# EAGLE design 12V24V led driver-1 (EAGLE 6.2)
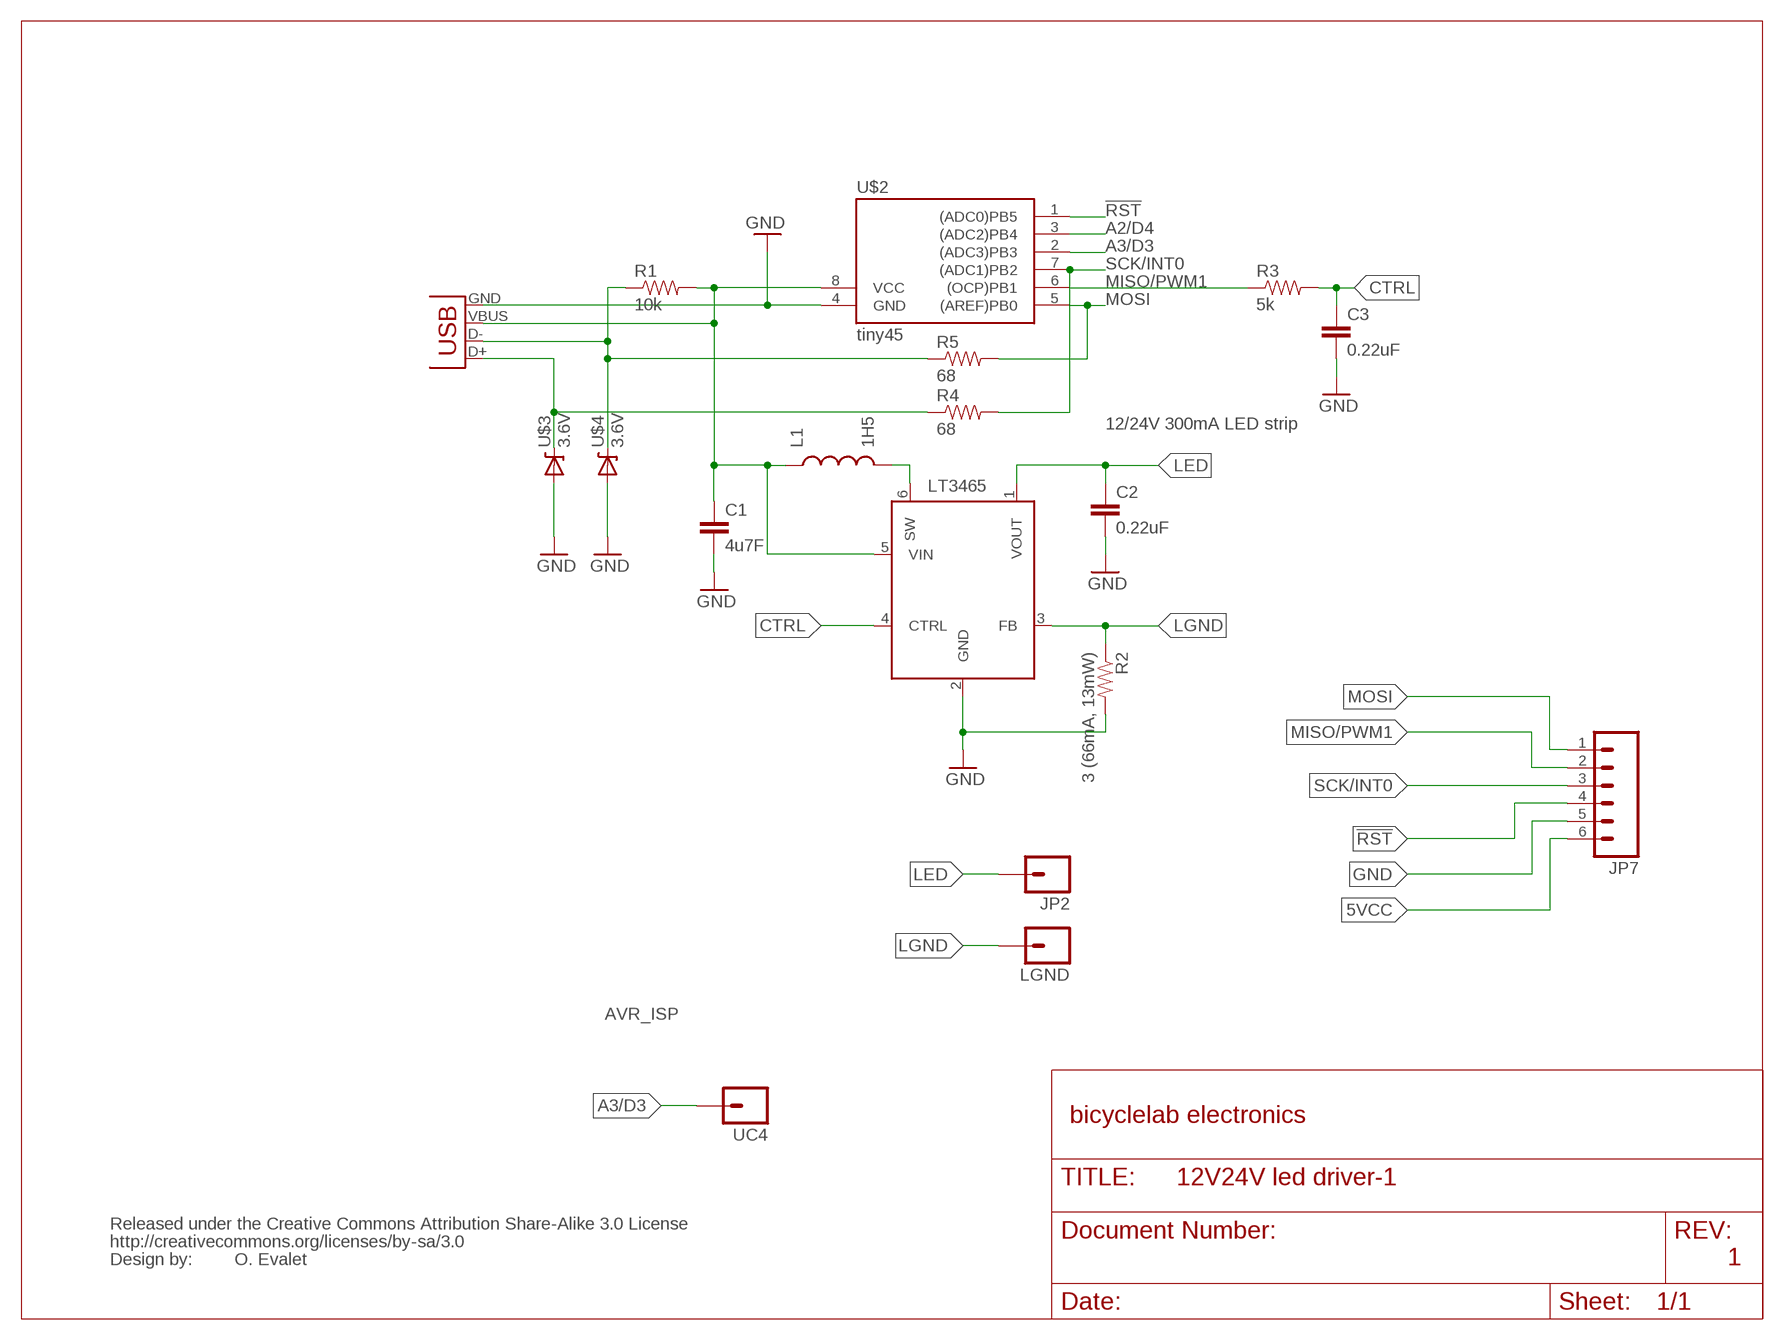
[diagram p0: schematic, sheet 1]

## Parts
C1  4u7F  CAP0805  [0805]
C2  0.22uF  CAP0603-CAP  [0603-CAP]
C3  0.22uF  CAP0805  [0805]
JP2  M01PTH  [1X01]
JP7  M06EM406  [EM406]
L1  1H5  INDUCTOR0805  [0805]
LGND  M01PTH  [1X01]
MISB-SW-5B  MISB-SW-5B  USB-MICROB  [USB-MICROB]
R1  10k  RESISTOR  [0805]
R2  3 (66mA, 13mW)  RESISTOR1206  [1206]
R3  5k  RESISTOR  [0805]
R4  68  RESISTOR  [0805]
R5  68  RESISTOR  [0805]
U$1  LT365  [TSOT23-6_DDC]
U$2  tiny45  TINY25/45/85-20SU  [SOIC8]
U$3  3.6V  DIODE-ZENER-BZT52  [SOD-323]
U$4  3.6V  DIODE-ZENER-BZT52  [SOD-323]
U$5  CREATIVE_COMMONS  [CREATIVE_COMMONS]
UC4  M01SMD-4.5X1.5  [PAD-1.5X4.5]

## Nets
5VCC: C1.1 JP7.6 L1.1 MISB-SW-5B.VBUS R1.2 U$1.5(VIN) U$2.8(VCC)
!RST: JP7.4 U$2.1((ADC0)PB5)
A2/D4: U$2.3((ADC2)PB4)
A3/D3: U$2.2((ADC3)PB3) UC4.P$1
CTRL: C3.1 R3.2 U$1.4(CTRL)
GND: C1.2 C2.2 C3.2 JP7.5 MISB-SW-5B.GND R2.2 U$1.2(GND) U$2.4(GND) U$3.2(A) U$4.2(A)
LED: C2.1 JP2.1 U$1.1(VOUT)
LGND: LGND.1 R2.1 U$1.3(FB)
MISO/PWM1: JP7.2 R3.1 U$2.6((OCP)PB1)
MOSI: JP7.1 R5.2 U$2.5((AREF)PB0)
N$1: MISB-SW-5B.D+ R4.1 U$3.1(C)
N$2: MISB-SW-5B.D- R1.1 R5.1 U$4.1(C)
N$3: L1.2 U$1.6(SW)
SCK/INT0: JP7.3 R4.2 U$2.7((ADC1)PB2)

## Notes on the sheet
- 12/24V 300mA LED strip
- AVR_ISP
- bicyclelab electronics
- O. Evalet | 1

## Library data of the parts
C1-C3 = SparkFun:CAP: Capacitor Standard 0603 ceramic capacitor, and 0.1" leaded capacitor.
JP2 LGND UC4 = SparkFun:M01: Header 1 Standard 1-pin 0.1" header. Use with straight break away headers (SKU : PRT-00116), right angle break away headers (PRT-00553), swiss pins (PRT-00743), machine pins (PRT-00117), and female headers (PRT-00115).
JP7 = 0-SparkFun:M06: Header 6 Standard 6-pin 0.1" header. Use with straight break away headers (SKU : PRT-00116), right angle break away headers (PRT-00553), swiss pins (PRT-00743), machine pins (PRT-00117), and female headers (PRT-00115). Molex polarized connector foot print use with SKU : PRT-08094 with associated crimp pins and housings. NOTES ON THE VARIANTS LOCK and LOCK_LONGPADS... This footprint was designed to help hold the alignment of a through-hole component (i.e. 6-pin header) while soldering it into place. You may notice that each hole has been shifted either up or down by 0.005 of an inch from it's more standard position (which is a perfectly straight line). This slight alteration caused the pins (the squares in the middle) to touch the edges of the holes. Because they are alternating, it causes a "brace" to hold the component in place. 0.005 has proven to be the perfect amount of "off-center" position when using our standard breakaway headers. Although looks a little odd when you look at the bare footprint, once you have a header in there, the alteration is very hard to notice. Also, if you push a header all the way into place, it is covered up entirely on the bottom side. This idea of altering the position of holes to aid alignment will be further integrated into the Sparkfun Library for other footprints. It can help hold any component with 3 or more connection pins.
L1 = 0-SparkFun:INDUCTOR: Inductors Basic Inductor/Choke - 0603 and 1206. Footprints are not proven and vary greatly between part numbers.
MISB-SW-5B = 0-SparkFun:USB: USB Connectors USB-B-PTH is fully proven SKU : PRT-00139 USB-miniB is fully proven SKU : PRT-00587 USB-A-PCB is untested. USB-A-H is throughly reviewed, but untested. Spark Fun Electronics SKU : PRT-00437 USB-B-SMT is throughly reviewed, but untested. Needs silkscreen touching up. USB-A-S has not been used/tested USB-MB-H has not been used/tested
R1-R5 = SparkFun:RESISTOR: Resistor Basic schematic elements and footprints for 0603, 1206, and PTH 1/10th watt (small) resistors.
U$1 = bicyclelab:LT365: 1.2MHz/2.4MHz White LED Drivers with Built-in Schottky in ThinSOT. The LT®3465/LT3465A are step-up DC/DC converters designed to drive up to six LEDs in series from a Li-Ion cell.
U$2 = 0-avr-7:TINY25/45/85
U$3 U$4 = 0-SparkFun:DIODE-ZENER: Zener Diode Production Part - 8199 3.4V Zener Voltage
U$5 = SparkFun:CREATIVE_COMMONS

## Net classes
0 default: width 0.203 mm
1 power: width 0.508 mm

## Board
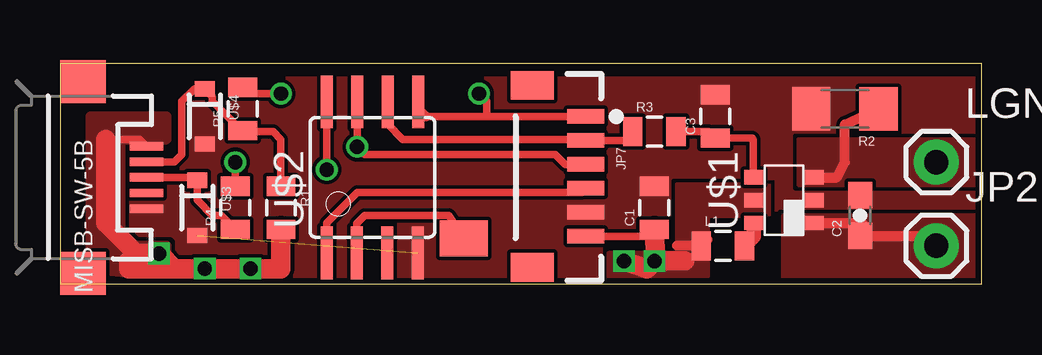
[diagram p1: board, top side]
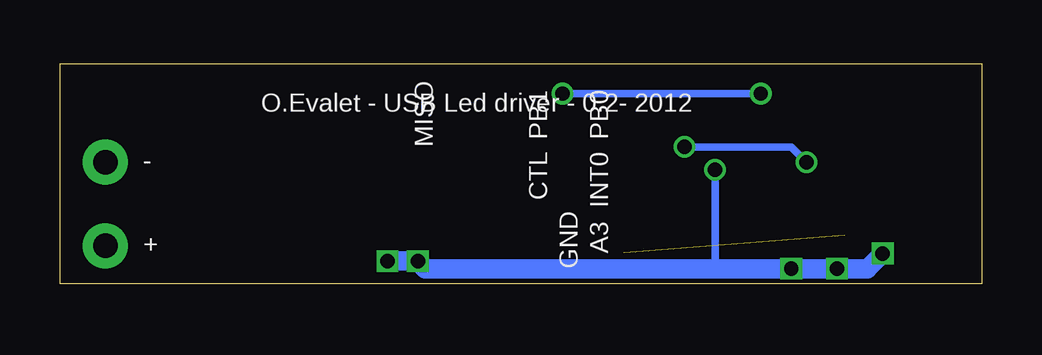
[diagram p2: board, bottom side, seen from below]

Size 38.41 x 9.2 mm. Coordinates in mm from the lower left corner, seen from the top.
Outline: 0,0 38.41,0 38.41,9.2 0,9.2 0,0
Copper layers (1*16): Top 0.035mm / dielectric 1.5mm / Bottom 0.035mm
Design rules: minimum track width 6mil, minimum drill 12mil, track to track 6mil, track to pad 6mil, pad to pad 6mil, via to via 6mil, smd to smd 0mil, copper to edge 10mil, drill to drill 10mil, minimum pad ring 10mil, minimum via ring 6mil, stop-mask expansion 2mil, vias tented up to drill 100mil, thermal gap 10mil

### Footprints (pad centres in the part's own frame; a part is rotated, then mirrored left to right if it is on the bottom)
0805 = smd 0.8 x 1.2: 1 -0.9,0; 2 0.9,0
0603-CAP = smd 1.1 x 1: 1 -0.85,0; 2 0.85,0
1X01 = drill 1.016 pad 1.88: 1 0,0
EM406 = smd 0.6 x 1.55: 1 0,0; 2 1,0; 3 2,0; 4 3,0; 5 4,0; 6 5,0 | smd 1.2 x 1.8: P$1 -1.3,-2.225; P$2 6.3,-2.225
USB-MICROB = smd 0.35 x 1.4: D+ 0,2.65; D- -0.65,2.65; GND 1.3,2.65; ID 0.65,2.65; VBUS -1.3,2.65 | smd 1.8 x 1.9: MT1 -4,0; MT2 4,0
1206 = smd 1.6 x 1.8: 1 -1.4,0; 2 1.4,0
TSOT23-6_DDC = smd 0.6 x 0.8: 1 -0.95,-1.25; 2 0,-1.25; 3 0.95,-1.25; 4 0.95,1.25; 5 0,1.25; 6 -0.95,1.25
SOIC8 = smd 0.5 x 2.2: 1 -1.905,-3.154; 2 -0.645,-3.154; 3 0.625,-3.154; 4 1.895,-3.154; 5 1.905,3.154; 6 0.635,3.154; 7 -0.635,3.154; 8 -1.905,3.154
SOD-323 = smd 0.63 x 0.83: 1 -1.15,0; 2 1.15,0
PAD-1.5X4.5 = smd 1.5 x 2: P$1 0,0

### Placement (x,y rotation side)
C1  24.77,3.18 90 top
C2  33.34,2.86 90 top
C3  27.3,6.99 90 top
JP2  36.51,1.59 0 top
JP7  21.91,6.99 270 top
L1  27.62,1.59 0 top
LGND  36.51,5.08 0 top
MISB-SW-5B  0.95,4.45 270 top
R1  9.21,3.18 270 top
R2  32.7,7.3 180 top
R3  24.77,6.35 0 top
R4  7.3,3.18 90 top
R5  7.62,7.3 90 top
U$1  30.16,3.49 90 top
U$2  13.02,4.45 0 top
U$3  5.71,3.18 270 top
U$4  6.03,6.99 270 top
U$5  -7.62,-10.16 0 top  (outside the outline)
UC4  16.83,1.91 90 top

### Tracks (layer width: path | path; a pad name or v marks a point on that pad's centre or on a via)
5VCC  (via drill 0.6)
  Top 0.305: 1.91,6.03 3.31,6.03 MISB-SW-5B.VBUS | 11.09,7.62 U$2.8 v11.11,4.76 | C1.1 24.48,1.99 JP7.6
  Top 0.406: 26.99,1.85 L1.1 25.72,1.59
  Top 0.813: R1.2 9.21,0.64 v7.94,0.64 v6.03,0.64 4.76,0.64 | 4.76,0.64 2.86,0.64 2.86,0.95 3.17,1.27 | 3.17,1.27 v4.13,1.27 4.76,0.64 | 3.17,1.27 1.91,2.54 1.91,6.03 | C1.1 24.82,1.01 v24.77,0.95 | v24.77,0.95 24.45,0.64 v23.5,0.95 | v24.77,0.95 26.04,0.95
  Bottom 0.305: v11.11,4.76 11.11,0.64
  Bottom 0.813: v4.13,1.27 4.76,0.64 v6.03,0.64 v7.94,0.64 11.11,0.64 23.18,0.64 v23.5,0.95 v24.77,0.95
  pour Top (rank 2, no thermals): 22.86,0.32 26.99,0.32 26.99,2.86 29.53,2.86 29.53,4.13 25.72,4.13 25.72,1.27 22.86,1.27
  pour Top (no thermals): 4.45,6.03 4.45,6.99 1.27,6.99 1.27,0.64 4.45,0.32 4.45,1.59 2.54,1.59 2.54,6.03
!RST
  Top 0.305: JP7.4 21.73,3.81 12.38,3.81 11.11,2.54 U$2.1
A3/D3
  Top 0.305: U$2.2 12.37,2.53 12.7,2.86 16.19,2.86 UC4.P$1
CTRL
  Top 0.305: U$1.4 28.89,4.46 28.89,6.03 28.84,6.08 C3.1 27.04,6.35 R3.2
GND  (1 unrouted)
  pour Top (rank 4, no thermals): 0,8.57 38.42,8.57 38.42,-0.32 0,-0.32
LED
  Top 0.406: U$1.1 33.44,2.54 C2.1 36.09,2.01 JP2.1
  pour Top (no thermals): 38.1,-0.32 30.16,-0.32 30.16,2.86 38.1,2.86
LGND
  Top 0.406: U$1.3 32.38,4.44 32.7,5.08 32.7,6.65 R2.1
  pour Top (no thermals): 38.1,4.13 30.8,4.13 30.8,6.03 38.1,6.03
MISO/PWM1
  Top 0.305: JP7.2 21.86,6.03 14.29,6.03 13.65,6.67 U$2.6 | JP7.2 22.01,6.08 | R3.1 23.5,5.99 JP7.2
MOSI  (via drill 0.6)
  Top 0.305: v9.21,7.94 7.88,7.94 R5.2 | JP7.1 17.78,6.99 | 17.78,6.99 15.24,6.99 | v17.46,7.94 17.78,7.62 17.78,6.99
  Top 0.406: U$2.5 14.92,7.3 15.24,6.99
  Bottom 0.305: v9.21,7.94 v17.46,7.94
N$1
  Top 0.305: MISB-SW-5B.D+ 5.59,4.45 U$3.1 5.71,3.49 6.35,2.86 6.72,2.86 R4.1
N$2
  Top 0.305: R1.1 9.21,6.03 8.89,6.35 7.67,6.35 R5.1 7.37,6.15 7.37,6.6 6.35,7.62 6.35,7.82 U$4.1 5.59,8.14 5.08,7.62 5.08,5.4 4.76,5.08 3.62,5.08 MISB-SW-5B.D-
N$3
  Top 0.61: U$1.6 28.91,1.98 L1.2
SCK/INT0  (via drill 0.6)
  Top 0.305: R4.2 v7.3,5.08 | U$2.7 v12.38,5.71 12.7,5.4 20.64,5.4 21.05,4.99 JP7.3 21.81,5.08
  Bottom 0.305: v12.38,5.71 7.94,5.71 v7.3,5.08

### Text on the board
bPlace: O.Evalet - USB Led driver - 0.2- 2012 | PB0 | PB1 | MISO | - | CTL | INT0 | A3 | + | GND
tValues: O.Evalet